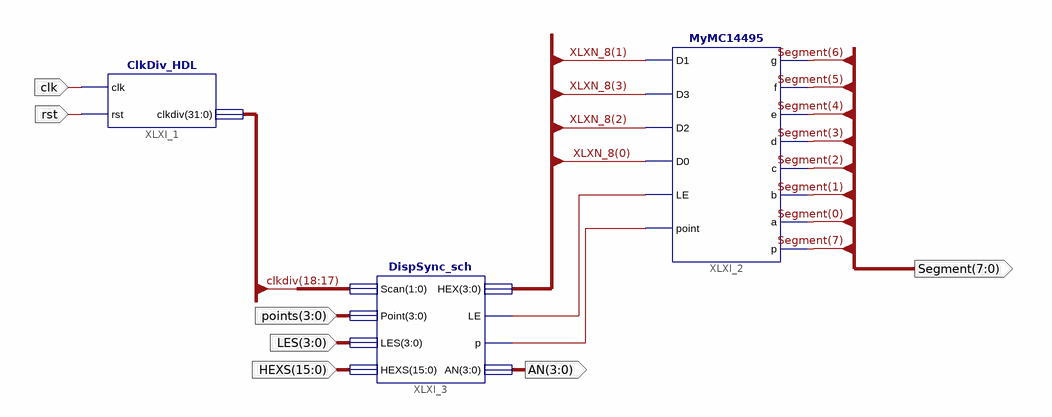
[diagram p0: schematic sheet 1]
// Xilinx ISE schematic DispNumLab7_sch.sch (kintex7) as structural Verilog: 3 symbols, 7 ports
module DispNumLab7_sch (
  input  [15:0] HEXS,
  input  [3:0] LES,
  input  [3:0] points,
  input  clk,
  input  rst,
  output [7:0] Segment,
  output [3:0] AN
);

  wire XLXN_10, XLXN_11;
  wire [3:0] XLXN_8;
  wire [31:0] clkdiv;

  MyMC14495 XLXI_2 (
    .D1(XLXN_8[1]), .D3(XLXN_8[3]), .D2(XLXN_8[2]), .D0(XLXN_8[0]), .LE(XLXN_10), .point(XLXN_11),
    .g(Segment[6]), .f(Segment[5]), .e(Segment[4]), .d(Segment[3]), .c(Segment[2]), .b(Segment[1]),
    .a(Segment[0]), .p(Segment[7]));
  DispSync_sch XLXI_3 (
    .Scan(clkdiv[18:17]), .Point(points), .LES(LES), .HEXS(HEXS), .HEX(XLXN_8), .LE(XLXN_10), .p(XLXN_11),
    .AN(AN));
  ClkDiv_HDL XLXI_1 (.clk(clk), .rst(rst), .clkdiv(clkdiv));
endmodule
